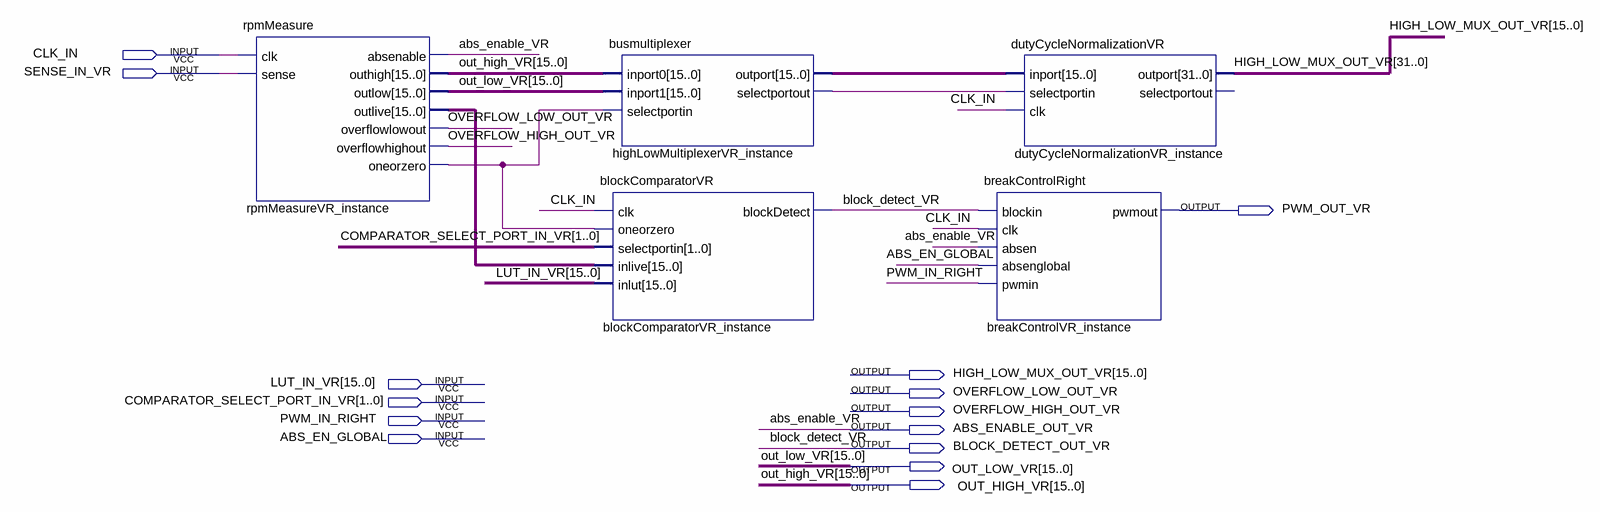
[diagram p0: schematic sheet]
// Quartus schematic absControlVR.bdf as structural Verilog: 5 symbols, 14 pins
module absControlVR (
  input  CLK_IN,
  input  SENSE_IN_VR,
  input  [15:0] LUT_IN_VR,
  input  [1:0] COMPARATOR_SELECT_PORT_IN_VR,
  input  PWM_IN_RIGHT,
  input  ABS_EN_GLOBAL,
  output PWM_OUT_VR,
  output [31:0] HIGH_LOW_MUX_OUT_VR,
  output OVERFLOW_LOW_OUT_VR,
  output OVERFLOW_HIGH_OUT_VR,
  output ABS_ENABLE_OUT_VR,
  output BLOCK_DETECT_OUT_VR,
  output [15:0] OUT_LOW_VR,
  output [15:0] OUT_HIGH_VR
);

  wire highLowMultiplexerVR_instance_selectportout, rpmMeasureVR_instance_oneorzero;
  wire [15:0] highLowMultiplexerVR_instance_outport, rpmMeasureVR_instance_outlive;

  rpmMeasure rpmMeasureVR_instance (
    .clk(CLK_IN), .sense(SENSE_IN_VR), .absenable(ABS_ENABLE_OUT_VR), .outhigh(OUT_HIGH_VR),
    .outlow(OUT_LOW_VR), .outlive(rpmMeasureVR_instance_outlive), .overflowlowout(OVERFLOW_LOW_OUT_VR),
    .overflowhighout(OVERFLOW_HIGH_OUT_VR), .oneorzero(rpmMeasureVR_instance_oneorzero));
  busmultiplexer highLowMultiplexerVR_instance (
    .inport0(OUT_HIGH_VR), .inport1(OUT_LOW_VR), .selectportin(rpmMeasureVR_instance_oneorzero),
    .outport(highLowMultiplexerVR_instance_outport),
    .selectportout(highLowMultiplexerVR_instance_selectportout));
  blockComparatorVR blockComparatorVR_instance (
    .clk(CLK_IN), .oneorzero(rpmMeasureVR_instance_oneorzero), .selectportin(COMPARATOR_SELECT_PORT_IN_VR),
    .inlive(rpmMeasureVR_instance_outlive), .inlut(LUT_IN_VR), .blockDetect(BLOCK_DETECT_OUT_VR));
  breakControlRight breakControlVR_instance (
    .blockin(BLOCK_DETECT_OUT_VR), .clk(CLK_IN), .absen(ABS_ENABLE_OUT_VR), .absenglobal(ABS_EN_GLOBAL),
    .pwmin(PWM_IN_RIGHT), .pwmout(PWM_OUT_VR));
  dutyCycleNormalizationVR dutyCycleNormalizationVR_instance (
    .inport(highLowMultiplexerVR_instance_outport),
    .selectportin(highLowMultiplexerVR_instance_selectportout), .clk(CLK_IN), .outport(HIGH_LOW_MUX_OUT_VR));  // open: selectportout

  // Other names for the same wires on the sheet: abs_enable_VR = ABS_ENABLE_OUT_VR;
  //   block_detect_VR = BLOCK_DETECT_OUT_VR
endmodule
